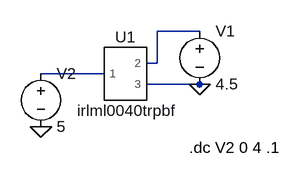
[diagram p0: schematic Q3_2_1.asc]
Q3_2_1.asc, the LTspice schematic file:
Version 4.1
SHEET 1 880 680
WIRE 320 96 256 96
WIRE 256 144 256 96
WIRE 256 144 240 144
WIRE 176 160 80 160
WIRE 320 176 240 176
WIRE 336 176 320 176
FLAG 320 176 0
FLAG 80 240 0
SYMBOL irlml0040trpbf 208 160 R0
SYMATTR InstName U1
SYMBOL voltage 320 80 R0
WINDOW 123 0 0 Left 0
WINDOW 39 0 0 Left 0
SYMATTR InstName V1
SYMATTR Value 4.5
SYMBOL voltage 80 144 R0
WINDOW 123 0 0 Left 0
WINDOW 39 0 0 Left 0
SYMATTR InstName V2
SYMATTR Value 5
TEXT 304 272 Left 2 !.dc V2 0 4 .1

The netlist it stands for:
* Q3_2_1.asc
X§U1 N002 N001 0 irlml0040trpbf  ; pins 1 2 3
V1 N001 0 4.5
V2 N002 0 5
.dc V2 0 4 .1
.lib C:\Users\kevin\Documents\ESE5800\Lab1\irlml0040trpbf.spi
.backanno
.end